# Altium schematic sheet Sheet1.SchDoc
size A3; SheetNumber: 1; SheetTotal: 1
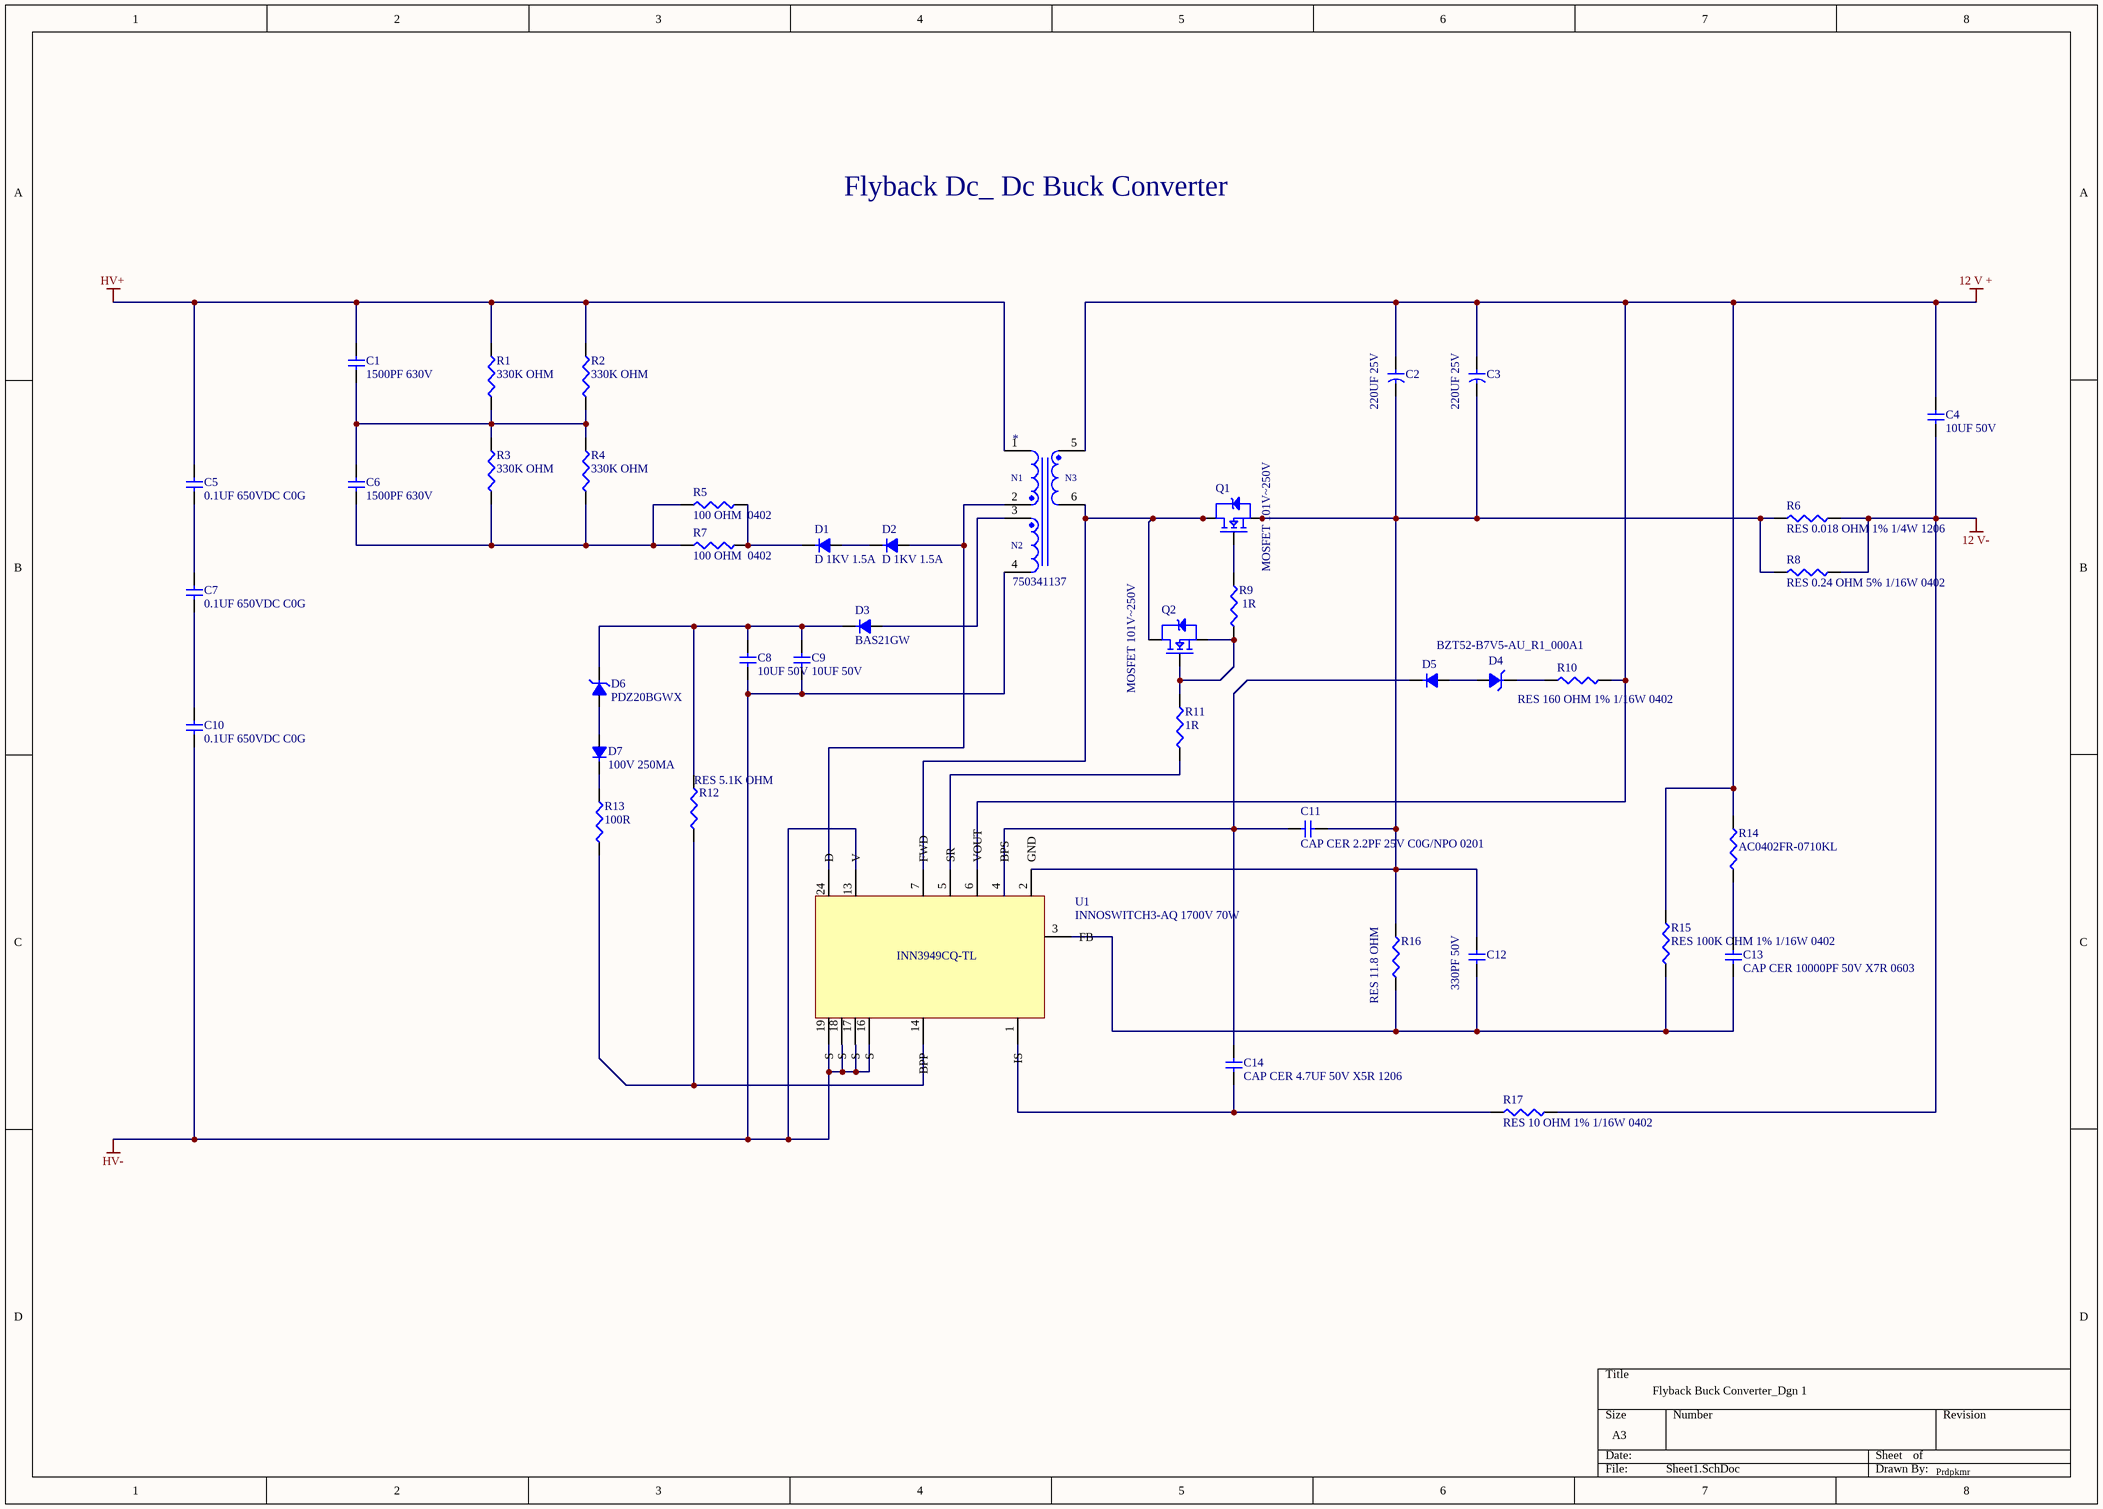
[diagram p0: Sheet1.SchDoc]

## Parts
*  750341137  [ERI25/10/18_250-1446]
C1  1500PF 630V
C2  220UF 25V
C3  220UF 25V
C4  10UF 50V
C5  0.1UF 650VDC C0G
C6  1500PF 630V
C7  0.1UF 650VDC C0G
C8  10UF 50V
C9  10UF 50V
C10  0.1UF 650VDC C0G
C11  CAP CER 2.2PF 25V C0G/NPO 0201
C12  330PF 50V
C13  CAP CER 10000PF 50V X7R 0603
C14  CAP CER 4.7UF 50V X5R 1206
D1  D 1KV 1.5A
D2  D 1KV 1.5A
D3  BAS21GW
D4  BZT52-B7V5-AU_R1_000A1
D5  (no value)
D6  PDZ20BGWX
D7  100V 250MA
Q1  MOSFET 101V~250V
Q2  MOSFET 101V~250V
R1  330K OHM
R2  330K OHM
R3  330K OHM
R4  330K OHM
R5  100 OHM  0402
R6  RES 0.018 OHM 1% 1/4W 1206
R7  100 OHM  0402
R8  RES 0.24 OHM 5% 1/16W 0402
R9  1R
R10  RES 160 OHM 1% 1/16W 0402
R11  1R
R12  RES 5.1K OHM
R13  100R
R14  AC0402FR-0710KL
R15  RES 100K OHM 1% 1/16W 0402
R16  RES 11.8 OHM
R17  RES 10 OHM 1% 1/16W 0402
U1  INNOSWITCH3-AQ 1700V 70W

## Nets
12 V +: *.5 C2.1 C3.1 C4.2 R10.2 R14.2 R15.2
12 V-: C4.1 R6.2 R8.2 R17.2
HV+: *.1 C1.2 C5.2 R1.2 R2.2
HV-: *.4 C8.1 C9.1 C10.1
Net*_2: *.2 D2.1
Net*_3: *.3 D3.1
Net*_6: *.6 Q1.2 Q2.2
NetC1_1: C1.1 C6.2 R1.1 R2.1 R3.2 R4.2
NetC2_2: C2.2 C3.2 C11.2 C12.2 Q1.3 R6.1 R8.1 R16.2
NetC5_1: C5.1 C7.2
NetC6_1: C6.1 R3.1 R4.1 R5.1 R7.1
NetC7_1: C7.1 C10.2
NetC8_2: C8.2 C9.2 D3.2 D6.2 R12.2
NetC11_1: C11.1 C14.2 D5.2 U1.4(BPS)
NetC12_1: C12.1 C13.1 R15.1 R16.1
NetC13_2: C13.2 R14.1
NetC14_1: C14.1 R17.1
NetD1_1: D1.1 D2.2
NetD1_2: D1.2 R5.2 R7.2
NetD4_1: D4.1 D5.1
NetD4_2: D4.2 R10.1
NetD6_1: D6.1 D7.1
NetD7_2: D7.2 R13.2
NetQ1_1: Q1.1 R9.2
NetQ2_1: Q2.1 Q2.3 R9.1 R11.2
NetR12_1: R12.1 R13.1

Not connected (* = marked no-connect by the designer): R11 1; U1 1(IS) 2(GND) 3(FB) 5(SR) 6(VOUT) 7(FWD) 13(V) 14(BPP) 16(S) 17(S) 18(S) 19(S) 24(D)

## Notes on the sheet
- Flyback Dc_ Dc Buck Converter
- Flyback Buck Converter_Dgn 1
- Prdpkmr
- (in symbol 750341137) N1; N3; N2

## Library data of the parts
* = 750341137: Transformer 480UH SMD; Manufacturer: Wurth Electronics; Frequency: 700kHz; Supplier: Digikey; Supplier Part Number: 732-4446-2-ND; Manufacturer Part Number: 750341137; RoHS: Yes; Category: Transformers; Pricing: 1035=9.33725 (USD); Mounting Technology: Surface Mount; Case/Package: SMD/SMT; Min Operating Temperature: -40°C; Max Operating Temperature: 125°C; Package Quantity: 1; Packaging: Tape and Reel; Termination: Terminals; Value: 480uH; Series: -; Length: 29.3mm; Width: 26.67mm; Height: 10.5mm; Height - Seated (Max): 10.5mm; RoHS Compliant: Yes; ComponentLink1URL: https://datasheet.ciiva.com/24028/750341137-254371-24028351.pdf?src-supplier=Mouser; ComponentLink1Description: https://datasheet.ciiva.com/24028/750341137-254371-24028351.pdf?src-supplier=Mouser
C1 C6 = CGA5H4C0G2J152J115AA: 1500 pF ±5% 630V Ceramic Capacitor C0G, NP0 1206 (3216 Metric); Manufacturer: TDK; Value: 1.5nF; Temperature Coefficient: 30ppm/°C; Description: Cap Ceramic 0.0015uF 630V C0G 5% Pad SMD 1206 125C Automotive T/R; Supplier: Digikey; Supplier Part Number: 445-5791-1-ND; Manufacturer Part Number: CGA5H4C0G2J152J115AA; RoHS: Yes; Category: Ceramic Capacitors; Stock: 26828; Pricing: 1=0.31, 10=0.185, 100=0.1193, 1000=0.08557, 2000=0.07299, 4000=0.06809, 6000=0.06774, 10000=0.06318, 14000=0.06088, 20000=0.06067, 50000=0.05812, 100000=0.05475 (USD); Mounting Technology: Surface Mount; Case/Package: 1206; Case Code (Metric): 3216; Case Code (Imperial): 1206; Weight: 0.000571oz; Material: Ceramic; Min Operating Temperature: -55°C; Max Operating Temperature: 125°C; Voltage Rating (DC): 630V; Tolerance: 5%; Packaging: Tape and Reel; Package Quantity: 1; Voltage Rating: 630V; Dielectric: C0G; Termination: SMD/SMT; Series: CGA; Length: 3.2mm; Width: 0.063inch; Height: 1.15mm; Thickness: 0.051inch; Depth: 1.6mm; Ratings: AEC-Q200; Reach SVHC Compliant: No; RoHS Compliant: Yes; ComponentLink1URL: http://www.farnell.com/datasheets/2130384.pdf?src-supplier=Farnell; ComponentLink1Description: http://www.farnell.com/datasheets/2130384.pdf?src-supplier=Farnell; ComponentLink2URL: http://components.arrow.com/part/dataview/57437045S460270N1165?src-supplier=Arrow+Electronics; ComponentLink2Description: http://components.arrow.com/part/dataview/57437045S460270N1165?src-supplier=Arrow+Electronics; ComponentLink3URL: http://www.mouser.com/ds/2/400/lcc_automotive_midvoltage_en-355485.pdf?src-supplier=Mouser; ComponentLink3Description: http://www.mouser.com/ds/2/400/lcc_automotive_midvoltage_en-355485.pdf?src-supplier=Mouser; ComponentLink4URL: https://product.tdk.com/info/en/documents/chara_sheet/CGA5H4C0G2J152J115AA.pdf?src-supplier=Digikey; ComponentLink4Description: https://product.tdk.com/info/en/documents/chara_sheet/CGA5H4C0G2J152J115AA.pdf?src-supplier=Digikey; ComponentLink5URL: https://product.tdk.com/info/en/catalog/spec/mlccspec_automotive_general_midvoltage_en.pdf?src-supplier=Digikey; ComponentLink5Description: https://product.tdk.com/info/en/catalog/spec/mlccspec_automotive_general_midvoltage_en.pdf?src-supplier=Digikey; ComponentLink6URL: https://datasheet.octopart.com/CGA5H4C0G2J152J115AA-TDK-datasheet-151546527.pdf?src-supplier=Farnell; ComponentLink6Description: https://datasheet.octopart.com/CGA5H4C0G2J152J115AA-TDK-datasheet-151546527.pdf?src-supplier=Farnell; ComponentLink7URL: https://datasheet.octopart.com/CGA5H4C0G2J152J115AA-TDK-datasheet-13376850.pdf?src-supplier=Newark; ComponentLink7Description: https://datasheet.octopart.com/CGA5H4C0G2J152J115AA-TDK-datasheet-13376850.pdf?src-supplier=Newark; ComponentLink8URL: http://www.farnell.com/datasheets/2130384.pdf?src-supplier=Element14; ComponentLink8Description: http://www.farnell.com/datasheets/2130384.pdf?src-supplier=Element14; ComponentLink9URL: http://www.tdk.co.jp/tefe02/e413_cga.pdf?src-supplier=Avnet; ComponentLink9Description: http://www.tdk.co.jp/tefe02/e413_cga.pdf?src-supplier=Avnet
C2 C3 = 875075561008: 220 µF 25 V Aluminum - Polymer Capacitors Radial, Can - SMD 15mOhm 2000 Hrs @ 105°C; Manufacturer: Wurth Electronics; ESR (Equivalent Series Resistance): 15mR; Ripple Current: 4.8A; Tolerance: 20%; Leakage Current: 1.1mA; Pitch: 10.3mm; Supplier: Digikey; Supplier Part Number: 732-6502-1-ND; Manufacturer Part Number: 875075561008; RoHS: Yes; Category: Polymer Capacitors; Stock: 759; Pricing: 1=2.03, 50=1.7352, 100=1.512 (USD); Mounting Technology: Surface Mount; Case/Package: Radial; Min Operating Temperature: -55°C; Max Operating Temperature: 105°C; Package Quantity: 1; Packaging: Cut Tape; Voltage Rating: 25V; Voltage Rating (DC): 25V; Value: 220uF; Series: WCAP-PSLC; Diameter: 10mm; Length: 12.4mm; Width: 10.3mm; Height - Seated (Max): 0.488inch; RoHS Compliant: Yes; Reach SVHC Compliant: Unknown; ComponentLink1URL: http://www.farnell.com/datasheets/1880469.pdf?src-supplier=Farnell; ComponentLink1Description: http://www.farnell.com/datasheets/1880469.pdf?src-supplier=Farnell; ComponentLink2URL: http://katalog.we-online.de/pbs/datasheet/875075561008.pdf?src-supplier=Digikey; ComponentLink2Description: http://katalog.we-online.de/pbs/datasheet/875075561008.pdf?src-supplier=Digikey; ComponentLink3URL: https://katalog.we-online.de/pbs/datasheet/875075561008.pdf?src-supplier=Digikey; ComponentLink3Description: https://katalog.we-online.de/pbs/datasheet/875075561008.pdf?src-supplier=Digikey; ComponentLink4URL: http://www.farnell.com/datasheets/1880469.pdf?src-supplier=Element14; ComponentLink4Description: http://www.farnell.com/datasheets/1880469.pdf?src-supplier=Element14
C4 = CC1210ZKY5V9BB106: 10 µF -20%, +80% 50V Ceramic Capacitor Y5V (F) 1210 (3225 Metric); Manufacturer: Yageo; Tolerance: 80%; Supplier: Future Electronics; Supplier Part Number: 7061931; Manufacturer Part Number: CC1210ZKY5V9BB106; RoHS: Yes; Category: Ceramic Capacitors; Stock: 502000; Pricing: 2000=0.106, 4000=0.105, 6000=0.104, 10000=0.102 (USD); Mounting Technology: Surface Mount; Case/Package: 1210; Case Code (Imperial): 1210; Case Code (Metric): 3225; Weight: 0.000564oz; Min Operating Temperature: -30°C; Max Operating Temperature: 85°C; Value: 10uF; Voltage Rating (DC): 50V; Packaging: Tape and Reel; Dielectric: Y5V; Voltage Rating: 50V; Series: CC; Length: 0.126inch; Width: 0.098inch; Lead Free: Lead Free; Halogen Free: Halogen Free; RoHS Compliant: Yes; ComponentLink1URL: http://www.yageo.com/documents/recent/UPY-GPHC_Y5V_6.3V-to-50V_7.pdf?src-supplier=Digikey; ComponentLink1Description: http://www.yageo.com/documents/recent/UPY-GPHC_Y5V_6.3V-to-50V_7.pdf?src-supplier=Digikey; ComponentLink2URL: http://www.yageo.com/documents/recent/UPY-GPHC_Y5V_6.3V-to-50V_8.pdf?src-supplier=Digikey; ComponentLink2Description: http://www.yageo.com/documents/recent/UPY-GPHC_Y5V_6.3V-to-50V_8.pdf?src-supplier=Digikey; ComponentLink3URL: https://www.yageo.com/upload/media/product/productsearch/datasheet/mlcc/UPY-GPHC_Y5V_6.3V-to-50V_9.pdf?src-supplier=Digikey; ComponentLink3Description: https://www.yageo.com/upload/media/product/productsearch/datasheet/mlcc/UPY-GPHC_Y5V_6.3V-to-50V_9.pdf?src-supplier=Digikey; ComponentLink4URL: https://datasheet.octopart.com/CC1210ZKY5V9BB106-Yageo-datasheet-78855689.pdf?src-supplier=Future+Electronics; ComponentLink4Description: https://datasheet.octopart.com/CC1210ZKY5V9BB106-Yageo-datasheet-78855689.pdf?src-supplier=Future+Electronics
C5 C7 C10 = CKC21C104KWGACAUTO: 0.1 µF ±10% 650V Ceramic Capacitor C0G, NP0 2220 (5750 Metric); Manufacturer: KEMET; Description: Kc-link 2220 0.1UF 650VDC C0G; Supplier: Mouser; Supplier Part Number: 80-CKC21C104KWGCAUTO; Manufacturer Part Number: CKC21C104KWGACAUTO; RoHS: No; Category: Ceramic Capacitors; Stock: 339; Pricing: 1=3.68, 10=2.61, 50=2.6, 100=2.04, 1000=1.65, 10000=1.63 (USD)
C8 C9 = CC1210ZKY5V9BB106: 10 µF -20%, +80% 50V Ceramic Capacitor Y5V (F) 1210 (3225 Metric); Manufacturer: Yageo; Tolerance: 80%; Description: 1210 10 uF 50 V -20 / +80 % Tolerance Y5V Multilayer Ceramic Capacitor; Supplier: Future Electronics; Supplier Part Number: 7061931; Manufacturer Part Number: CC1210ZKY5V9BB106; RoHS: Yes; Category: Ceramic Capacitors; Stock: 502000; Pricing: 2000=0.106, 4000=0.105, 6000=0.104, 10000=0.102 (USD); Mounting Technology: Surface Mount; Case/Package: 1210; Case Code (Imperial): 1210; Case Code (Metric): 3225; Weight: 0.000564oz; Min Operating Temperature: -30°C; Max Operating Temperature: 85°C; Value: 10uF; Voltage Rating (DC): 50V; Packaging: Tape and Reel; Dielectric: Y5V; Voltage Rating: 50V; Series: CC; Length: 0.126inch; Width: 0.098inch; Lead Free: Lead Free; Halogen Free: Halogen Free; RoHS Compliant: Yes; ComponentLink1URL: http://www.yageo.com/documents/recent/UPY-GPHC_Y5V_6.3V-to-50V_7.pdf?src-supplier=Digikey; ComponentLink1Description: http://www.yageo.com/documents/recent/UPY-GPHC_Y5V_6.3V-to-50V_7.pdf?src-supplier=Digikey; ComponentLink2URL: http://www.yageo.com/documents/recent/UPY-GPHC_Y5V_6.3V-to-50V_8.pdf?src-supplier=Digikey; ComponentLink2Description: http://www.yageo.com/documents/recent/UPY-GPHC_Y5V_6.3V-to-50V_8.pdf?src-supplier=Digikey; ComponentLink3URL: https://www.yageo.com/upload/media/product/productsearch/datasheet/mlcc/UPY-GPHC_Y5V_6.3V-to-50V_9.pdf?src-supplier=Digikey; ComponentLink3Description: https://www.yageo.com/upload/media/product/productsearch/datasheet/mlcc/UPY-GPHC_Y5V_6.3V-to-50V_9.pdf?src-supplier=Digikey; ComponentLink4URL: https://datasheet.octopart.com/CC1210ZKY5V9BB106-Yageo-datasheet-78855689.pdf?src-supplier=Future+Electronics; ComponentLink4Description: https://datasheet.octopart.com/CC1210ZKY5V9BB106-Yageo-datasheet-78855689.pdf?src-supplier=Future+Electronics
C11 = CC0201CRNPO8BN2R2: 2.2 pF ±0.25pF 25V Ceramic Capacitor C0G, NP0 0201 (0603 Metric); Manufacturer: Yageo; Supplier: Future Electronics; Supplier Part Number: 8113593; Manufacturer Part Number: CC0201CRNPO8BN2R2; RoHS: Yes; Category: Ceramic Capacitors; Stock: 15000; Pricing: 15000=0.0015, 60000=0.0014, 150000=0.0014, 375000=0.0014, 600000=0.0013 (USD); Mounting Technology: Surface Mount; Case/Package: 0201; Case Code (Imperial): 0201; Case Code (Metric): 0603; Min Operating Temperature: -55°C; Max Operating Temperature: 125°C; Packaging: Cut Tape; Value: 2.2pF; Voltage Rating: 25V; Series: CC; Length: 0.024inch; Width: 0.012inch; Thickness: 0.013inch; RoHS Compliant: Yes; ComponentLink1URL: http://www.yageo.com/NewPortal/yageodocoutput?fileName=/pdf/MLCC/UPY-GP_NP0_16V-to-50V_14.pdf&src-supplier=Digikey; ComponentLink1Description: http://www.yageo.com/NewPortal/yageodocoutput?fileName=/pdf/MLCC/UPY-GP_NP0_16V-to-50V_14.pdf&src-supplier=Digikey; ComponentLink2URL: https://www.yageo.com/upload/media/product/productsearch/datasheet/mlcc/UPY-GP_NP0_16V-to-50V_18.pdf?src-supplier=Digikey; ComponentLink2Description: https://www.yageo.com/upload/media/product/productsearch/datasheet/mlcc/UPY-GP_NP0_16V-to-50V_18.pdf?src-supplier=Digikey
C12 = CC0402KRX7R9BB331: 330 pF ±10% 50V Ceramic Capacitor X7R 0402 (1005 Metric); Manufacturer: Yageo; Insulation Resistance: 100GR; Temperature Coefficient: 30ppm/°C; Supplier: Future Electronics; Supplier Part Number: 6360333; Manufacturer Part Number: CC0402KRX7R9BB331; RoHS: Yes; Category: Ceramic Capacitors; Stock: 80000; Pricing: 10000=0.0017, 40000=0.0016, 150000=0.0015, 300000=0.0015, 750000=0.0014 (USD); Mounting Technology: Surface Mount; Case/Package: 0402; Case Code (Imperial): 0402; Case Code (Metric): 1005; Dielectric Material: Ceramic; Material: Ceramic; Min Operating Temperature: -55°C; Max Operating Temperature: 125°C; Value: 330pF; Packaging: Tape and Reel; Tolerance: 10%; Voltage Rating: 50V; Voltage Rating (DC): 50V; Package Quantity: 1; Dielectric: X7R; Termination: SMD/SMT; Series: CC; Voltage Rating (AC): 50V; Length: 1mm; Width: 0.02inch; Height: 0.5mm; Thickness: 0.022inch; Depth: 0.5mm; Radiation Hardening: No; Reach SVHC Compliant: No; Lead Free: Lead Free; Halogen Free: Halogen Free; RoHS Compliant: Yes; ComponentLink1URL: https://datasheet.ciiva.com/143/mlccorderingcode-143965.pdf?src-supplier=Digikey; ComponentLink1Description: https://datasheet.ciiva.com/143/mlccorderingcode-143965.pdf?src-supplier=Digikey; ComponentLink2URL: https://datasheet.ciiva.com/143/mlccorderingcode-143966.pdf?src-supplier=Digikey; ComponentLink2Description: https://datasheet.ciiva.com/143/mlccorderingcode-143966.pdf?src-supplier=Digikey; ComponentLink3URL: https://datasheet.ciiva.com/143/mlccorderingcode-143967.pdf?src-supplier=Digikey; ComponentLink3Description: https://datasheet.ciiva.com/143/mlccorderingcode-143967.pdf?src-supplier=Digikey; ComponentLink4URL: https://datasheet.ciiva.com/11464/upy-gphc-x7r-6-3v-to-50v-8-11464908.pdf?src-supplier=Avnet; ComponentLink4Description: https://datasheet.ciiva.com/11464/upy-gphc-x7r-6-3v-to-50v-8-11464908.pdf?src-supplier=Avnet; ComponentLink5URL: https://datasheet.ciiva.com/7978/1489800-7978101.pdf?src-supplier=Element14; ComponentLink5Description: https://datasheet.ciiva.com/7978/1489800-7978101.pdf?src-supplier=Element14; ComponentLink6URL: https://datasheet.ciiva.com/8033/1489800-8033628.pdf?src-supplier=Element14; ComponentLink6Description: https://datasheet.ciiva.com/8033/1489800-8033628.pdf?src-supplier=Element14; ComponentLink7URL: https://datasheet.ciiva.com/8033/1489800-8033629.pdf?src-supplier=Element14; ComponentLink7Description: https://datasheet.ciiva.com/8033/1489800-8033629.pdf?src-supplier=Element14; ComponentLink8URL: https://datasheet.ciiva.com/46394/1489800-46394572.pdf?src-supplier=Element14; ComponentLink8Description: https://datasheet.ciiva.com/46394/1489800-46394572.pdf?src-supplier=Element14; ComponentLink9URL: https://datasheet.ciiva.com/5425/upy-gphc-x7r-6-3v-to-50v-8-5425451.pdf?src-supplier=Mouser; ComponentLink9Description: https://datasheet.ciiva.com/5425/upy-gphc-x7r-6-3v-to-50v-8-5425451.pdf?src-supplier=Mouser
C13 = CC0603KRX7R9BB103: 10000 pF ±10% 50V Ceramic Capacitor X7R 0603 (1608 Metric); Manufacturer: Yageo; Value: 10nF; Insulation Resistance: 100GR; Supplier: Future Electronics; Supplier Part Number: 4131256; Manufacturer Part Number: CC0603KRX7R9BB103; RoHS: Yes; Category: Ceramic Capacitors; Stock: 3216000; Pricing: 4000=0.003, 16000=0.0029, 60000=0.0028, 160000=0.0027, 400000=0.0026 (USD); Mounting Technology: Surface Mount; Case/Package: 0603; Pins: 2; Case Code (Metric): 1608; Case Code (Imperial): 0603; Material: Ceramic; Min Operating Temperature: -55°C; Max Operating Temperature: 125°C; Tolerance: 10%; Packaging: Tape and Reel; Voltage Rating: 50V; Voltage Rating (DC): 50V; Package Quantity: 1; Dielectric: X7R; Termination: SMD/SMT; Voltage: 50V; Series: CC; Length: 1.6mm; Width: 0.031inch; Height: 0.8mm; Thickness: 0.035inch; Depth: 0.8mm; Radiation Hardening: No; Lead Free: Lead Free; RoHS Compliant: Yes; Reach SVHC Compliant: Unknown; Halogen Free: 5694HalogenFree; ComponentLink1URL: https://datasheet.ciiva.com/26862/getdatasheetpartid-403582-26862846.pdf?src-supplier=Verical; ComponentLink1Description: https://datasheet.ciiva.com/26862/getdatasheetpartid-403582-26862846.pdf?src-supplier=Verical; ComponentLink2URL: https://datasheet.ciiva.com/11788/0900766b8079c870-11788374.pdf?src-supplier=Rs; ComponentLink2Description: https://datasheet.ciiva.com/11788/0900766b8079c870-11788374.pdf?src-supplier=Rs; ComponentLink3URL: https://datasheet.ciiva.com/176/mlccorderingcode-176550.pdf?src-supplier=Digikey; ComponentLink3Description: https://datasheet.ciiva.com/176/mlccorderingcode-176550.pdf?src-supplier=Digikey; ComponentLink4URL: https://datasheet.ciiva.com/176/mlccorderingcode-176551.pdf?src-supplier=Digikey; ComponentLink4Description: https://datasheet.ciiva.com/176/mlccorderingcode-176551.pdf?src-supplier=Digikey; ComponentLink5URL: https://datasheet.ciiva.com/176/mlccorderingcode-176552.pdf?src-supplier=Digikey; ComponentLink5Description: https://datasheet.ciiva.com/176/mlccorderingcode-176552.pdf?src-supplier=Digikey; ComponentLink6URL: https://datasheet.ciiva.com/8033/1734573-8033816.pdf?src-supplier=Element14; ComponentLink6Description: https://datasheet.ciiva.com/8033/1734573-8033816.pdf?src-supplier=Element14; ComponentLink7URL: https://datasheet.ciiva.com/8033/70765-8033817.pdf?src-supplier=Element14; ComponentLink7Description: https://datasheet.ciiva.com/8033/70765-8033817.pdf?src-supplier=Element14; ComponentLink8URL: https://datasheet.ciiva.com/8033/1734573-8033861.pdf?src-supplier=Element14; ComponentLink8Description: https://datasheet.ciiva.com/8033/1734573-8033861.pdf?src-supplier=Element14; ComponentLink9URL: https://datasheet.ciiva.com/28450/1489800-28450619.pdf?src-supplier=Element14; ComponentLink9Description: https://datasheet.ciiva.com/28450/1489800-28450619.pdf?src-supplier=Element14; ComponentLink10URL: https://datasheet.ciiva.com/13389/upy-gphc-x7r-6-3v-to-50v-8-13389991.pdf?src-supplier=Mouser; ComponentLink10Description: https://datasheet.ciiva.com/13389/upy-gphc-x7r-6-3v-to-50v-8-13389991.pdf?src-supplier=Mouser
C14 = CC1206KKX5R9BB475: 4.7 µF ±10% 50V Ceramic Capacitor X5R 1206 (3216 Metric); Manufacturer: Yageo; Supplier: Future Electronics; Supplier Part Number: 7083448; Manufacturer Part Number: CC1206KKX5R9BB475; RoHS: Yes; Category: Ceramic Capacitors; Stock: 10000; Pricing: 2000=0.056, 6000=0.0545, 8000=0.0541, 20000=0.0529, 30000=0.0518 (USD); Mounting Technology: Surface Mount; Case/Package: 1206; Pins: 2; Case Code (Metric): 3216; Case Code (Imperial): 1206; Weight: 0.000571oz; Material: Ceramic; Min Operating Temperature: -55°C; Max Operating Temperature: 85°C; Packaging: Tape and Reel; Value: 4.7uF; Voltage Rating: 50V; Tolerance: 10%; Dielectric: X5R; Termination: SMD/SMT; Voltage Rating (DC): 50V; Package Quantity: 2000; Series: CC; Length: 0.126inch; Width: 0.063inch; Height: 1.45mm; Thickness: 0.071inch; Lead Free: Lead Free; Halogen Free: Halogen Free; RoHS Compliant: Yes; ComponentLink1URL: http://www.mouser.com/ds/2/447/Yageo_UPY-GP_NP0_16V-to-50V_9-358835.pdf?src-supplier=Mouser; ComponentLink1Description: http://www.mouser.com/ds/2/447/Yageo_UPY-GP_NP0_16V-to-50V_9-358835.pdf?src-supplier=Mouser; ComponentLink2URL: http://www.yageo.com/documents/recent/UPY-GPHC_X5R_4V-to-50V_25.pdf?src-supplier=Digikey; ComponentLink2Description: http://www.yageo.com/documents/recent/UPY-GPHC_X5R_4V-to-50V_25.pdf?src-supplier=Digikey; ComponentLink3URL: https://datasheet.octopart.com/CC1206KKX5R9BB475-Yageo-datasheet-158238148.pdf?src-supplier=Newark; ComponentLink3Description: https://datasheet.octopart.com/CC1206KKX5R9BB475-Yageo-datasheet-158238148.pdf?src-supplier=Newark; ComponentLink4URL: https://datasheet.octopart.com/CC1206KKX5R9BB475-Yageo-datasheet-170350636.pdf?src-supplier=Future+Electronics; ComponentLink4Description: https://datasheet.octopart.com/CC1206KKX5R9BB475-Yageo-datasheet-170350636.pdf?src-supplier=Future+Electronics
D1 D2 = BYG23MHE3_A/I: Diode 1000 V 1.5A Surface Mount DO-214AC (SMA); Manufacturer: Vishay; Supplier: Mouser; Supplier Part Number: 78-BYG23MHE3_A/I; Manufacturer Part Number: BYG23MHE3_A/I; RoHS: Yes; Category: Rectifier Diodes; Stock: 5398; Pricing: 1=0.48, 10=0.32, 50=0.32, 100=0.205, 1000=0.14, 10000=0.112 (USD); RoHS Compliant: Yes
D3 = BAS21GWX: Diode 200 V 225mA Surface Mount SOD-123; Manufacturer: Nexperia; Supplier: Digikey; Supplier Part Number: 1727-7323-1-ND; Manufacturer Part Number: BAS21GWX; RoHS: Yes; Category: Rectifier Diodes; Stock: 49148; Pricing: 1=0.11, 10=0.073, 100=0.054, 500=0.04164, 1000=0.0363 (USD); RoHS Compliant: Yes; ComponentLink1URL: http://www.farnell.com/datasheets/2290146.pdf?src-supplier=Farnell; ComponentLink1Description: http://www.farnell.com/datasheets/2290146.pdf?src-supplier=Farnell; ComponentLink2URL: https://datasheet.octopart.com/BAS21GWX-Nexperia-datasheet-87842693.pdf?src-supplier=Future+Electronics; ComponentLink2Description: https://datasheet.octopart.com/BAS21GWX-Nexperia-datasheet-87842693.pdf?src-supplier=Future+Electronics; ComponentLink3URL: http://www.farnell.com/datasheets/2290146.pdf?src-supplier=Newark; ComponentLink3Description: http://www.farnell.com/datasheets/2290146.pdf?src-supplier=Newark; ComponentLink4URL: https://datasheet.octopart.com/BAS21GWX-Nexperia-datasheet-82522482.pdf?src-supplier=Newark; ComponentLink4Description: https://datasheet.octopart.com/BAS21GWX-Nexperia-datasheet-82522482.pdf?src-supplier=Newark; ComponentLink5URL: http://www.farnell.com/datasheets/2290146.pdf?src-supplier=Element14; ComponentLink5Description: http://www.farnell.com/datasheets/2290146.pdf?src-supplier=Element14
D4 = BZT52-B7V5-AU_R1_000A1: Zener Diode 7.5 V 410 mW ±2% Surface Mount SOD-123; Manufacturer: Panjit; Supplier: Digikey; Supplier Part Number: 3757-BZT52-B7V5-AU_R1_000A1CT-ND; Manufacturer Part Number: BZT52-B7V5-AU_R1_000A1; Stock: 2870; Pricing: 1=0.13, 10=0.089, 100=0.046, 500=0.0435, 1000=0.041 (USD)
D5 = BAS16J,115: Diode 100 V 250mA Surface Mount SOD-323F; Manufacturer: Nexperia; Value: 1.5pF; Max Forward Surge Current (Ifsm): 500mA; Max Repetitive Reverse Voltage (Vrrm): 100V; Max Reverse Current: 500nA; Supplier: Future Electronics; Supplier Part Number: 4759361; Manufacturer Part Number: BAS16J,115; RoHS: Yes; Category: Rectifier Diodes; Stock: 279000; Pricing: 3000=0.0139, 9000=0.0136, 15000=0.0135, 60000=0.013, 90000=0.0128 (USD); Pins: 2; Max Operating Temperature: 150°C; Forward Current: 250mA; Reverse Voltage: 100V; Height: 800um; RoHS Compliant: Yes; ComponentLink1URL: http://www.farnell.com/datasheets/1856332.pdf?src-supplier=Farnell; ComponentLink1Description: http://www.farnell.com/datasheets/1856332.pdf?src-supplier=Farnell; ComponentLink2URL: https://assets.nexperia.com/documents/data-sheet/BAS16_SER.pdf?src-supplier=Digikey; ComponentLink2Description: https://assets.nexperia.com/documents/data-sheet/BAS16_SER.pdf?src-supplier=Digikey; ComponentLink3URL: http://www.farnell.com/datasheets/1856332.pdf?src-supplier=Newark; ComponentLink3Description: http://www.farnell.com/datasheets/1856332.pdf?src-supplier=Newark; ComponentLink4URL: https://datasheet.octopart.com/BAS16J%2C115-Nexperia-datasheet-81455687.pdf?src-supplier=TME; ComponentLink4Description: https://datasheet.octopart.com/BAS16J%2C115-Nexperia-datasheet-81455687.pdf?src-supplier=TME
D6 = PDZ20BGWX: DIODE ZENER 20V 365MW SOD123; Manufacturer: Nexperia; Supplier: Digikey; Supplier Part Number: 1727-PDZ20BGWXCT-ND; Manufacturer Part Number: PDZ20BGWX; RoHS: Yes; Category: Zener Diodes; Stock: 4330; Pricing: 1=0.17, 10=0.106, 100=0.0652, 500=0.04742, 1000=0.04163 (USD); RoHS Compliant: Yes; ComponentLink1URL: https://datasheet.octopart.com/PDZ20BGWX-Nexperia-datasheet-96189609.pdf?src-supplier=Farnell; ComponentLink1Description: https://datasheet.octopart.com/PDZ20BGWX-Nexperia-datasheet-96189609.pdf?src-supplier=Farnell
D7 = BAS16J,115: Diode 100 V 250mA Surface Mount SOD-323F; Manufacturer: Nexperia; Value: 1.5pF; Max Forward Surge Current (Ifsm): 500mA; Max Reverse Current: 500nA; Supplier: Future Electronics; Supplier Part Number: 4759361; Manufacturer Part Number: BAS16J,115; RoHS: Yes; Category: Rectifier Diodes; Stock: 279000; Pricing: 3000=0.0139, 9000=0.0136, 15000=0.0135, 60000=0.013, 90000=0.0128 (USD); Pins: 2; Max Operating Temperature: 150°C; Forward Current: 250mA; Max Repetitive Reverse Voltage (Vrrm): 100V; Reverse Voltage: 100V; Height: 800um; RoHS Compliant: Yes; ComponentLink1URL: http://www.farnell.com/datasheets/1856332.pdf?src-supplier=Farnell; ComponentLink1Description: http://www.farnell.com/datasheets/1856332.pdf?src-supplier=Farnell; ComponentLink2URL: https://assets.nexperia.com/documents/data-sheet/BAS16_SER.pdf?src-supplier=Digikey; ComponentLink2Description: https://assets.nexperia.com/documents/data-sheet/BAS16_SER.pdf?src-supplier=Digikey; ComponentLink3URL: http://www.farnell.com/datasheets/1856332.pdf?src-supplier=Newark; ComponentLink3Description: http://www.farnell.com/datasheets/1856332.pdf?src-supplier=Newark; ComponentLink4URL: https://datasheet.octopart.com/BAS16J%2C115-Nexperia-datasheet-81455687.pdf?src-supplier=TME; ComponentLink4Description: https://datasheet.octopart.com/BAS16J%2C115-Nexperia-datasheet-81455687.pdf?src-supplier=TME
Q1 Q2 = DMTH15H017LPSWQ-13: N-Channel 150 V 8A (Ta), 50A (Tc) 1.5W (Ta), 107W (Tc) Surface Mount, Wettable Flank PowerDI5060-8 (Type UX); Manufacturer: Diodes; Drain to Source Breakdown Voltage: 150V; Drain to Source Resistance: 13mR; Gate to Source Voltage (Vgs): 20V; Number of Channels: 1; Turn-Off Delay Time: 44.6ns; Turn-On Delay Time: 10.5ns; Supplier: Digikey; Supplier Part Number: 31-DMTH15H017LPSWQ-13CT-ND; Manufacturer Part Number: DMTH15H017LPSWQ-13; RoHS: No; Category: MOSFETs; Stock: 3956; Pricing: 1=1.92, 10=1.428, 100=1.0169, 500=0.91924, 1000=0.82222 (USD); Min Operating Temperature: -55°C; Max Operating Temperature: 175°C; Continuous Drain Current (ID): 8A; Drain to Source Voltage (Vdss): 150V; Power Dissipation: 1.5W; Height: 1.1mm
R1 = CRMV1210AF330KFKEF: 330 kOhms ±1% 0.35W Chip Resistor 1210 (3225 Metric) High Voltage Thick Film; Manufacturer: Vishay; Description: CRMV1210AF 330K 1% 100 Ef E3; Supplier: Mouser; Supplier Part Number: 71-CRMV1210AF330KFKF; Manufacturer Part Number: CRMV1210AF330KFKEF; Category: Chip SMD Resistors; Stock: 8000; Pricing: 1=0.61, 10=0.333, 50=0.333, 100=0.206, 1000=0.144, 10000=0.117 (USD)
R2-R4 = CRMV1210AF330KFKEF: 330 kOhms ±1% 0.35W Chip Resistor 1210 (3225 Metric) High Voltage Thick Film; Manufacturer: Vishay; Supplier: Mouser; Supplier Part Number: 71-CRMV1210AF330KFKF; Manufacturer Part Number: CRMV1210AF330KFKEF; Category: Chip SMD Resistors; Stock: 8000; Pricing: 1=0.61, 10=0.333, 50=0.333, 100=0.206, 1000=0.144, 10000=0.117 (USD)
R5 R7 = M55342K11B100DRS3: 100 Ohms ±1% 0.05W, 1/20W Chip Resistor 0402 (1005 Metric) Military Thick Film; Manufacturer: Vishay Dale; Value: 100R; Max Power Dissipation: 50mW; Temperature Coefficient: 100ppm/°C; Supplier: Mouser; Supplier Part Number: 75-M55342K11B100DRS3; Manufacturer Part Number: M55342K11B100DRS3; RoHS: No; Category: Chip SMD Resistors; Stock: 980; Pricing: 1=1.82, 10=1.24, 50=1.24, 100=0.962, 1000=0.836, 10000=0.75 (USD); Case/Package: 0402; Case Code (Metric): 1005; Case Code (Imperial): 0402; Contact Plating: Tin,Lead; Min Operating Temperature: -55°C; Max Operating Temperature: 150°C; Package Quantity: 1; Tolerance: 1%; Packaging: Tape and Reel; Number of Terminations: 2; Failure Rate: 0.01%; Features: Military; Series: Military, MIL-PRF-55342, RM0402; Construction: Rectangular; Length: 0.039inch; Width: 0.02inch; Height: 0.016inch; Depth: 0.51mm; Radiation Hardening: No; Military Standard: MIL-PRF-55342; RoHS Compliant: No; ComponentLink1URL: https://datasheet.ciiva.com/2528/rcwpm-2528448.pdf?src-supplier=Digikey; ComponentLink1Description: https://datasheet.ciiva.com/2528/rcwpm-2528448.pdf?src-supplier=Digikey; ComponentLink2URL: https://datasheet.ciiva.com/14075/rcwpm-14075307.pdf?src-supplier=Digikey; ComponentLink2Description: https://datasheet.ciiva.com/14075/rcwpm-14075307.pdf?src-supplier=Digikey; ComponentLink3URL: https://datasheet.ciiva.com/14075/rcwpm-14075308.pdf?src-supplier=Digikey; ComponentLink3Description: https://datasheet.ciiva.com/14075/rcwpm-14075308.pdf?src-supplier=Digikey; ComponentLink4URL: https://datasheet.ciiva.com/8980/rcwpm-8980509.pdf?src-supplier=Avnet; ComponentLink4Description: https://datasheet.ciiva.com/8980/rcwpm-8980509.pdf?src-supplier=Avnet
R6 = RL1206FR-070R018L: Res Thick Film 1206 0.018 Ohm 1% 1/4W ±1500ppm/°C Molded SMD SMD Paper T/R; Manufacturer: Yageo; Value: 18mR; Power Rating: 250mW; Supplier: Digikey; Supplier Part Number: 311-.018LWCT-ND; Manufacturer Part Number: RL1206FR-070R018L; RoHS: Yes; Category: Chip SMD Resistors; Stock: 9267; Pricing: 1=0.39, 10=0.14, 100=0.0938 (USD); Mounting Technology: Surface Mount; Case/Package: 1206; Case Code (Imperial): 1206; Case Code (Metric): 3216; Contact Plating: Tin,Matte; Weight: 0.000571oz; Min Operating Temperature: -55°C; Max Operating Temperature: 125°C; Tolerance: 1%; Packaging: Tape and Reel; Termination: SMD/SMT; Temperature Coefficient: 1500ppm/°C; Package Quantity: 5000; Features: Moisture Resistant,Automotive AEC-Q200; Series: RL; Max Power Dissipation: 250mW; Number of Terminations: 2; Technology: THICK FILM; Length: 3.1mm; Width: 1.6mm; Height: 0.55mm; Depth: 1.6mm; Ratings: AEC-Q200; Lead Free: Lead Free; RoHS Compliant: Yes; ComponentLink1URL: https://datasheet.ciiva.com/11819/0900766b808536cc-11819987.pdf?src-supplier=Rs; ComponentLink1Description: https://datasheet.ciiva.com/11819/0900766b808536cc-11819987.pdf?src-supplier=Rs; ComponentLink2URL: https://datasheet.ciiva.com/15328/pyu-rl-521-rohs-l-5-15328585.pdf?src-supplier=Mouser; ComponentLink2Description: https://datasheet.ciiva.com/15328/pyu-rl-521-rohs-l-5-15328585.pdf?src-supplier=Mouser
R8 = PT0402JR-070R24L: Current Sensor-Low TCR Chip Resistor Thick Film 0402 240mOhm 5% Paper T/R; Manufacturer: Yageo; Value: 240mR; Max Power Dissipation: 63mW; Temperature Coefficient: 200ppm/°C; Supplier: Digikey; Supplier Part Number: PT0402JR-070R24L-ND; Manufacturer Part Number: PT0402JR-070R24L; RoHS: Yes; Category: Chip SMD Resistors; Pricing: 10000=0.04053 (USD); Case/Package: 0402; Min Operating Temperature: -55°C; Max Operating Temperature: 155°C; Packaging: Tape and Reel; Number of Terminations: 2; Tolerance: 5%; Features: Moisture Resistant,Automotive AEC-Q200; Series: PT; Ratings: AEC-Q200; RoHS Compliant: Yes; ComponentLink1URL: https://www.yageo.com/upload/media/product/productsearch/datasheet/rchip/PYu-PT-Group_521_RoHS_L_2.pdf?src-supplier=Digikey; ComponentLink1Description: https://www.yageo.com/upload/media/product/productsearch/datasheet/rchip/PYu-PT-Group_521_RoHS_L_2.pdf?src-supplier=Digikey
R9 R11 = CR0402AF/-1R00GAS: 1 Ohms ±1% 0.063W, 1/16W Chip Resistor 0402 (1005 Metric) Anti-Sulfur, Automotive AEC-Q200, Moisture Resistant Thick Film; Manufacturer: Bourns; Power Rating: 63mW; Voltage Rating: 50V; Supplier: Arrow Electronics; Supplier Part Number: CR0402AF/-1R00GAS; Manufacturer Part Number: CR0402AF/-1R00GAS; RoHS: Yes; Category: Chip SMD Resistors; Stock: 60000; Pricing: 10000=0.0012 (USD); Case/Package: 0402; Min Operating Temperature: -55°C; Max Operating Temperature: 155°C; Value: 1R; Tolerance: 1%; Height: 370um
R10 = RC0402FR-07160RL: SMD Chip Resistor, 160 Ohm, ï¿½ 1%, 63 mW, 0402 [1005 Metric], Thick Film, General Purpose; Manufacturer: Yageo; Power Rating: 63mW; Voltage Rating: 50V; Value: 160R; Temperature Coefficient: 100ppm/°C; Supplier: Digikey; Supplier Part Number: 311-160LRCT-ND; Manufacturer Part Number: RC0402FR-07160RL; RoHS: Yes; Category: Chip SMD Resistors; Stock: 58812; Pricing: 1=0.1, 10=0.007, 100=0.0041, 1000=0.00357, 2500=0.00306 (USD); Case/Package: 0402; Pins: 2; Case Code (Metric): 1005; Case Code (Imperial): 0402; Min Operating Temperature: -55°C; Max Operating Temperature: 155°C; Tolerance: 1%; Package Quantity: 1; Packaging: Tape and Reel; Resistor Type: Thick Film; Number of Terminations: 2; Termination: SMD/SMT; Max Power Dissipation: 63mW; Voltage Rating (DC): 50V; Features: Moisture Resistant; Series: RC; Construction: Rectangular; Resistance Tolerance: 1%; Length: 1mm; Width: 0.5mm; Height: 0.016inch; Depth: 0.5mm; Reach SVHC Compliant: No; Military Standard: Not; Lead Free: Lead Free; RoHS Compliant: Yes; ComponentLink1URL: https://datasheet.ciiva.com/2453/pyu-r-int-thick-7-2453577.pdf?src-supplier=Digikey; ComponentLink1Description: https://datasheet.ciiva.com/2453/pyu-r-int-thick-7-2453577.pdf?src-supplier=Digikey; ComponentLink2URL: https://datasheet.ciiva.com/2453/pyu-r-int-thick-7-2453578.pdf?src-supplier=Digikey; ComponentLink2Description: https://datasheet.ciiva.com/2453/pyu-r-int-thick-7-2453578.pdf?src-supplier=Digikey; ComponentLink3URL: https://datasheet.ciiva.com/2453/pyu-r-int-thick-7-2453579.pdf?src-supplier=Digikey; ComponentLink3Description: https://datasheet.ciiva.com/2453/pyu-r-int-thick-7-2453579.pdf?src-supplier=Digikey; ComponentLink4URL: https://datasheet.ciiva.com/7849/1018594-7849845.pdf?src-supplier=Element14; ComponentLink4Description: https://datasheet.ciiva.com/7849/1018594-7849845.pdf?src-supplier=Element14; ComponentLink5URL: https://datasheet.ciiva.com/7849/1018594-7849846.pdf?src-supplier=Element14; ComponentLink5Description: https://datasheet.ciiva.com/7849/1018594-7849846.pdf?src-supplier=Element14; ComponentLink6URL: https://datasheet.ciiva.com/16742/pyu-rc0402-51-rohs-l-6-r-16742782.pdf?src-supplier=Future+Electronics; ComponentLink6Description: https://datasheet.ciiva.com/16742/pyu-rc0402-51-rohs-l-6-r-16742782.pdf?src-supplier=Future+Electronics; ComponentLink7URL: https://datasheet.ciiva.com/26829/getdatasheetpartid-325097-26829915.pdf?src-supplier=Verical; ComponentLink7Description: https://datasheet.ciiva.com/26829/getdatasheetpartid-325097-26829915.pdf?src-supplier=Verical
R12 = RC0402FR-075K1L: 5.1 kOhms ±1% 0.063W, 1/16W Chip Resistor 0402 (1005 Metric) Moisture Resistant Thick Film; Manufacturer: Yageo; Power Rating: 63mW; Voltage Rating: 50V; Value: 5.1kR; Temperature Coefficient: 100ppm/°C; Supplier: Future Electronics; Supplier Part Number: 6053649; Manufacturer Part Number: RC0402FR-075K1L; RoHS: Yes; Category: Chip SMD Resistors; Stock: 240000; Pricing: 10000=0.0007, 50000=0.0007, 200000=0.0007, 500000=0.0007, 1250000=0.0006 (USD); Case/Package: 0402; Case Code (Metric): 1005; Case Code (Imperial): 0402; Min Operating Temperature: -55°C; Max Operating Temperature: 155°C; Tolerance: 1%; Packaging: Tape and Reel; Package Quantity: 1; Resistor Type: Thick Film; Number of Terminations: 2; Termination: SMD/SMT; Max Power Dissipation: 63mW; Voltage Rating (DC): 50V; Features: Moisture Resistant; Series: RC; Resistance Tolerance: 1%; Technology: THICK FILM; Working Voltage: 50V; Construction: Rectangular; Length: 1mm; Width: 0.02inch; Height: 0.016inch; Depth: 0.5mm; Lead Free: Lead Free; RoHS Compliant: Yes; Reach SVHC Compliant: Unknown; Military Standard: Not
R13 = RT0402BRD07100RL: 100 Ohms ±0.1% 0.063W, 1/16W Chip Resistor 0402 (1005 Metric) Thin Film; Manufacturer: Yageo; Power Rating: 62.5mW; Voltage Rating: 50V; Max Power Dissipation: 63mW; Temperature Coefficient: 25ppm/°C; Supplier: Future Electronics; Supplier Part Number: 1099085; Manufacturer Part Number: RT0402BRD07100RL; RoHS: Yes; Category: Chip SMD Resistors; Stock: 7178; Pricing: 1=0.147, 20=0.109, 150=0.0828, 1000=0.0585, 5000=0.0379 (USD); Case/Package: 0402; Case Code (Imperial): 0402; Case Code (Metric): 1005; Weight: 2.3E-05oz; Contact Plating: Tin,Lead; Min Operating Temperature: -55°C; Max Operating Temperature: 155°C; Value: 100R; Tolerance: 0.1%; Packaging: Tape and Reel; Number of Terminations: 2; Package Quantity: 10000; Termination: SMD/SMT; Voltage Rating (DC): 50V; Features: Moisture Resistant; Series: RT; Length: 0.039inch; Width: 0.5mm; Height: 0.014inch; Lead Free: Lead Free; RoHS Compliant: Yes; ComponentLink1URL: https://datasheet.ciiva.com/12797/pyu-rt-1-to-0-05-rohs-l-4-12797129.pdf?src-supplier=Mouser; ComponentLink1Description: https://datasheet.ciiva.com/12797/pyu-rt-1-to-0-05-rohs-l-4-12797129.pdf?src-supplier=Mouser
R14 = AC0402FR-0710KL: SMD Chip Resistor, 10 kOhm, ï¿½ 1%, 62.5 mW, 0402 [1005 Metric], Thick Film, General Purpose; Manufacturer: Yageo; Value: 10kR; Power Rating: 62.5mW; Voltage Rating: 50V; Temperature Coefficient: 100ppm/°C; Max Power Dissipation: 63mW; Supplier: Future Electronics; Supplier Part Number: 2025338; Manufacturer Part Number: AC0402FR-0710KL; RoHS: Yes; Category: Chip SMD Resistors; Stock: 15445000; Pricing: 10000=0.0011, 40000=0.001, 150000=0.001, 400000=0.001, 1000000=0.0009 (USD); Case/Package: 0402; Case Code (Imperial): 0402; Case Code (Metric): 1005; Min Operating Temperature: -55°C; Max Operating Temperature: 155°C; Tolerance: 1%; Packaging: Tape and Reel; Termination: SMD/SMT; Number of Terminations: 2; Features: Moisture Resistant,Automotive AEC-Q200; Series: AC; Length: 0.039inch; Width: 0.02inch; Height: 0.015inch; RoHS Compliant: Yes; ComponentLink1URL: https://datasheet.ciiva.com/12656/pyu-ac-51-rohs-l-2-12656634.pdf?src-supplier=Mouser; ComponentLink1Description: https://datasheet.ciiva.com/12656/pyu-ac-51-rohs-l-2-12656634.pdf?src-supplier=Mouser
R15 = RC0402FR-07100KL: Res General Purpose Thick Film 0402 100K Ohm 1% 1/16W ±100ppm/°C Molded SMD Paper T/R; Manufacturer: Yageo; Power Rating: 63mW; Voltage Rating: 50V; Value: 100kR; Supplier: Future Electronics; Supplier Part Number: 6468466; Manufacturer Part Number: RC0402FR-07100KL; RoHS: Yes; Category: Chip SMD Resistors; Stock: 34050000; Pricing: 10000=0.0007, 50000=0.0007, 200000=0.0007, 500000=0.0007, 1250000=0.0006 (USD); Case/Package: 0402; Case Code (Metric): 1005; Case Code (Imperial): 0402; Min Operating Temperature: -55°C; Max Operating Temperature: 155°C; Tolerance: 1%; Packaging: Tape and Reel; Resistor Type: Thick Film; Number of Terminations: 2; Termination: SMD/SMT; Temperature Coefficient: 100ppm/°C; Max Power Dissipation: 63mW; Features: Moisture Resistant; Series: RC; Resistance Tolerance: 1%; Construction: Rectangular; Technology: THICK FILM; Voltage Rating (AC): 50V; Package Quantity: 1; Length: 0.039inch; Width: 0.02inch; Height: 0.016inch; Depth: 0.5mm; Reach SVHC Compliant: No; Military Standard: Not; Lead Free: Lead Free; RoHS Compliant: Yes
R16 = RC0402FR-0711R8L: Res Thick Film 0402 11.8 Ohm 1% 0.063W(1/16W) ±100ppm/C Pad SMD T/R; Manufacturer: Yageo; Value: 11.8R; Power Rating: 62.5mW; Voltage Rating: 50V; Max Power Dissipation: 63mW; Temperature Coefficient: 100ppm/°C; Supplier: Digikey; Supplier Part Number: YAG2961CT-ND; Manufacturer Part Number: RC0402FR-0711R8L; RoHS: Yes; Category: Chip SMD Resistors; Stock: 25855; Pricing: 1=0.1, 10=0.008, 100=0.0051, 1000=0.00459, 2500=0.00408 (USD); Case/Package: 0402; Case Code (Imperial): 0402; Case Code (Metric): 1005; Contact Plating: Tin,Matte; Min Operating Temperature: -55°C; Max Operating Temperature: 155°C; Tolerance: 1%; Packaging: Tape and Reel; Number of Terminations: 2; Termination: SMD/SMT; Features: Moisture Resistant; Series: RC; Length: 0.039inch; Width: 0.5mm; Height: 0.016inch; RoHS Compliant: Yes; ComponentLink1URL: https://datasheet.ciiva.com/8891/pyu-rc0402-51-rohs-l-6-8891080.pdf?src-supplier=Avnet; ComponentLink1Description: https://datasheet.ciiva.com/8891/pyu-rc0402-51-rohs-l-6-8891080.pdf?src-supplier=Avnet; ComponentLink2URL: https://datasheet.ciiva.com/12561/pyu-rc0402-51-rohs-l-6-r-8721-12561260.pdf?src-supplier=Mouser; ComponentLink2Description: https://datasheet.ciiva.com/12561/pyu-rc0402-51-rohs-l-6-r-8721-12561260.pdf?src-supplier=Mouser
R17 = RC0402FR-0710RL: Res Thick Film 0402 11.8 Ohm 1% 0.063W(1/16W) ±100ppm/C Pad SMD T/R; Manufacturer: Yageo; Power Rating: 62.5mW; Voltage Rating: 50V; Value: 10R; Temperature Coefficient: 200ppm/°C; Max Power Dissipation: 63mW; Supplier: Digikey; Supplier Part Number: 311-10.0LRCT-ND; Manufacturer Part Number: RC0402FR-0710RL; RoHS: Yes; Category: Chip SMD Resistors; Stock: 589245; Pricing: 1=0.1, 10=0.011, 100=0.0082, 1000=0.00612, 2500=0.0051, 10000=0.0039, 20000=0.00349, 30000=0.00329, 50000=0.00307, 70000=0.00295, 100000=0.00283, 250000=0.00259, 500000=0.00245, 1000000=0.00234 (USD); Case/Package: 0402; Case Code (Imperial): 0402; Case Code (Metric): 1005; Min Operating Temperature: -55°C; Max Operating Temperature: 155°C; Tolerance: 1%; Packaging: Tape and Reel; Termination: SMD/SMT; Resistor Type: Thick Film; Number of Terminations: 2; Features: Moisture Resistant; Series: RC; Resistance Tolerance: 1%; Technology: THICK FILM; Construction: Rectangular; Working Voltage: 50V; Voltage Rating (AC): 50V; Length: 1mm; Height: 0.32mm; Depth: 0.5mm; Reach SVHC Compliant: No; Military Standard: Not; Lead Free: Lead Free; RoHS Compliant: Yes; ComponentLink1URL: https://datasheet.ciiva.com/11808/0900766b80c66297-11808764.pdf?src-supplier=Rs; ComponentLink1Description: https://datasheet.ciiva.com/11808/0900766b80c66297-11808764.pdf?src-supplier=Rs; ComponentLink2URL: https://datasheet.ciiva.com/46394/1018594-46394954.pdf?src-supplier=Element14; ComponentLink2Description: https://datasheet.ciiva.com/46394/1018594-46394954.pdf?src-supplier=Element14; ComponentLink3URL: https://datasheet.ciiva.com/15189/getdatasheetpartid-323697-15189339.pdf?src-supplier=Verical; ComponentLink3Description: https://datasheet.ciiva.com/15189/getdatasheetpartid-323697-15189339.pdf?src-supplier=Verical; ComponentLink4URL: https://datasheet.ciiva.com/7849/1018594-7849818.pdf?src-supplier=Element14; ComponentLink4Description: https://datasheet.ciiva.com/7849/1018594-7849818.pdf?src-supplier=Element14; ComponentLink5URL: https://datasheet.ciiva.com/7849/1018594-7849819.pdf?src-supplier=Element14; ComponentLink5Description: https://datasheet.ciiva.com/7849/1018594-7849819.pdf?src-supplier=Element14; Contact Plating: Tin,Matte; Width: 0.5mm; ComponentLink6URL: https://datasheet.ciiva.com/8891/pyu-rc0402-51-rohs-l-6-8891080.pdf?src-supplier=Avnet; ComponentLink6Description: https://datasheet.ciiva.com/8891/pyu-rc0402-51-rohs-l-6-8891080.pdf?src-supplier=Avnet; ComponentLink7URL: https://datasheet.ciiva.com/12561/pyu-rc0402-51-rohs-l-6-r-8721-12561260.pdf?src-supplier=Mouser; ComponentLink7Description: https://datasheet.ciiva.com/12561/pyu-rc0402-51-rohs-l-6-r-8721-12561260.pdf?src-supplier=Mouser
U1 = INN3949CQ-TL: Ac-Dc Conv, Flyback, -40 To 150Deg C Rohs Compliant: Yes |Power Integrations INN3949CQ-TL; Supplier: Digikey; Supplier Part Number: 596-INN3949CQ-TLCT-ND; Manufacturer: Power Integrations; Manufacturer Part Number: INN3949CQ-TL; RoHS: No; Stock: 1849; Pricing: 1=15.11, 100=12.4903 (USD)